# Altium schematic sheet vcu_2_0.SchDoc
size A4; SheetNumber: 1; SheetTotal: 6
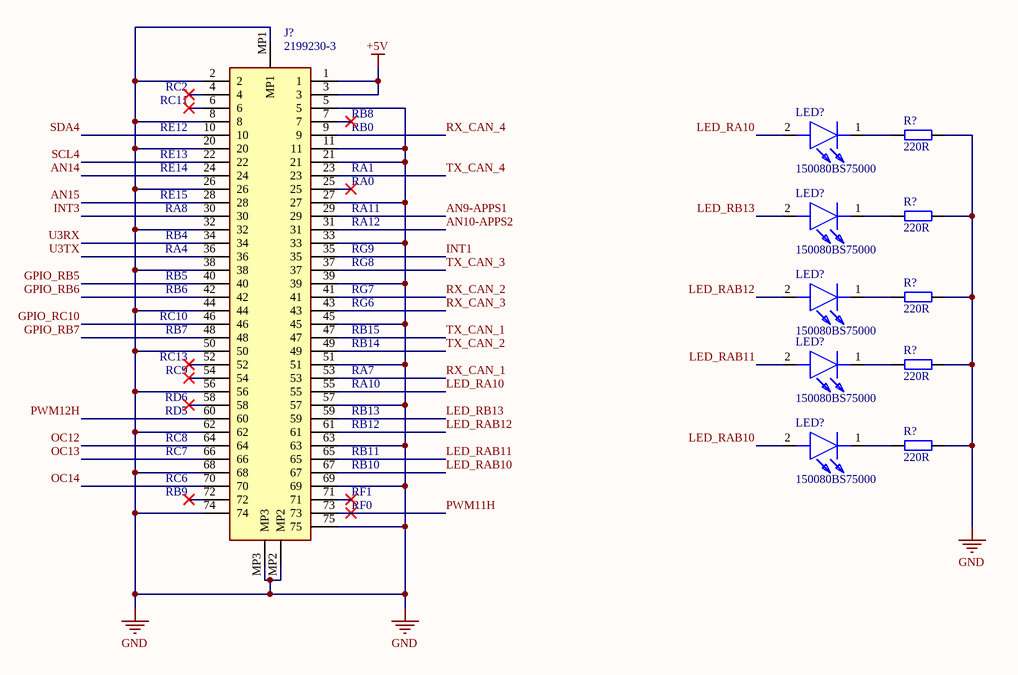
[diagram p0: vcu_2_0.SchDoc]

## Parts
(Parts that share a designator on the sheet are numbered #1, #2 ... from top to bottom, then left to right.)
J?  2199230-3  [21992303]
LED?#1  150080BS75000  [LEDC2012X80N]
LED?#2  150080BS75000  [LEDC2012X80N]
LED?#3  150080BS75000  [LEDC2012X80N]
LED?#4  150080BS75000  [LEDC2012X80N]
LED?#5  150080BS75000  [LEDC2012X80N]
R?#1  220R  [RES_0805]
R?#2  220R  [RES_0805]
R?#3  220R  [RES_0805]
R?#4  220R  [RES_0805]
R?#5  220R  [RES_0805]

## Nets
+5V: J?.1 J?.3
GND: J?.2 J?.5 J?.8 J?.11 J?.20 J?.21 J?.26 J?.27 J?.32 J?.33 J?.38 J?.39 J?.44 J?.45 J?.50 J?.51 J?.56 J?.57 J?.62 J?.63 J?.68 J?.69 J?.74 J?.75 J?.MP1 J?.MP2 J?.MP3 R?#1.1 R?#2.1 R?#3.1 R?#4.1 R?#5.1
AN9-APPS1: J?.29
AN10-APPS2: J?.31
AN14: J?.24
AN15: J?.28
GPIO_RB5: J?.40
GPIO_RB6: J?.42
GPIO_RB7: J?.48
GPIO_RC10: J?.46
INT1: J?.35
INT3: J?.30
LED_RA10: J?.55 LED?#1.2(A)
LED_RAB10: J?.67 LED?#5.2(A)
LED_RAB11: J?.65 LED?#4.2(A)
LED_RAB12: J?.61 LED?#3.2(A)
LED_RB13: J?.59 LED?#2.2(A)
OC12: J?.64
OC13: J?.66
OC14: J?.70
PWM11H: J?.73
PWM12H: J?.60
RX_CAN_1: J?.53
RX_CAN_2: J?.41
RX_CAN_3: J?.43
RX_CAN_4: J?.9
SCL4: J?.22
SDA4: J?.10
TX_CAN_1: J?.47
TX_CAN_2: J?.49
TX_CAN_3: J?.37
TX_CAN_4: J?.23
U3RX: J?.34
U3TX: J?.36
NetLED?#1_1: LED?#1.1(K) R?#1.2
NetLED?#2_1: LED?#2.1(K) R?#2.2
NetLED?#3_1: LED?#3.1(K) R?#3.2
NetLED?#4_1: LED?#4.1(K) R?#4.2
NetLED?#5_1: LED?#5.1(K) R?#5.2

Not connected (* = marked no-connect by the designer): J? 4* 6* 7* 25* 52* 54* 58* 71* 72*

## Notes on the sheet
- (near J?) RC2
- (near J?) RC11
- (near J?) RE12
- (near J?) RE13
- (near J?) RB0
- (near J?) RB8
- (near J?) RE14
- (near J?) RE15
- (near J?) RA8
- (near J?) RA1
- (near J?) RA0
- (near J?) RA11
- (near J?) RA12
- (near J?) RB4
- (near J?) RA4
- (near J?) RB5
- (near J?) RB6
- (near J?) RG7
- (near J?) RG8
- (near J?) RG9
- (near J?) RC10
- (near J?) RB7
- (near J?) RC13
- (near J?) RB15
- (near J?) RB14
- (near J?) RG6
- (near J?) RC9
- (near J?) RD6
- (near J?) RD5
- (near J?) RA7
- (near J?) RA10
- (near J?) RB13
- (near J?) RB12
- (near J?) RC8
- (near J?) RC7
- (near J?) RC6
- (near J?) RB9
- (near J?) RB11
- (near J?) RB10
- (near J?) RF1
- (near J?) RF0

## Library data of the parts
J? = 2199230-3: Connector; Manufacturer_Name: TE Connectivity; Datasheet Link: https://componentsearchengine.com/Datasheets/2/2199230-3.pdf; Height: 4.2mm; Manufacturer_Part_Number: 2199230-3; Mouser Part Number: 571-2199230-3; Mouser Price/Stock: https://www.mouser.co.uk/ProductDetail/TE-Connectivity/2199230-3?qs=EQCnRgr4b6HElQOKr5ma1Q%3D%3D; Arrow Part Number: 2199230-3; Arrow Price/Stock: https://www.arrow.com/en/products/2199230-3/te-connectivity?region=nac
LED?#1-LED?#5 = 150080BS75000: LED; Manufacturer_Name: Wurth Elektronik; Datasheet Link: https://katalog.we-online.com/led/datasheet/150080BS75000.pdf; Height: 0.8mm; Manufacturer_Part_Number: 150080BS75000; Mouser Part Number: 710-150080BS75000; Mouser Price/Stock: https://www.mouser.co.uk/ProductDetail/Wurth-Elektronik/150080BS75000?qs=2kOmHSv6VfT2tBo3UPVqAQ%3D%3D
R?#1-R?#5 = RES_0805: Resistor SMD 0805